# Altium schematic sheet mPCIe_Slot.SchDoc
size 594 x 420 mm; SheetNumber: 20; SheetTotal: 20
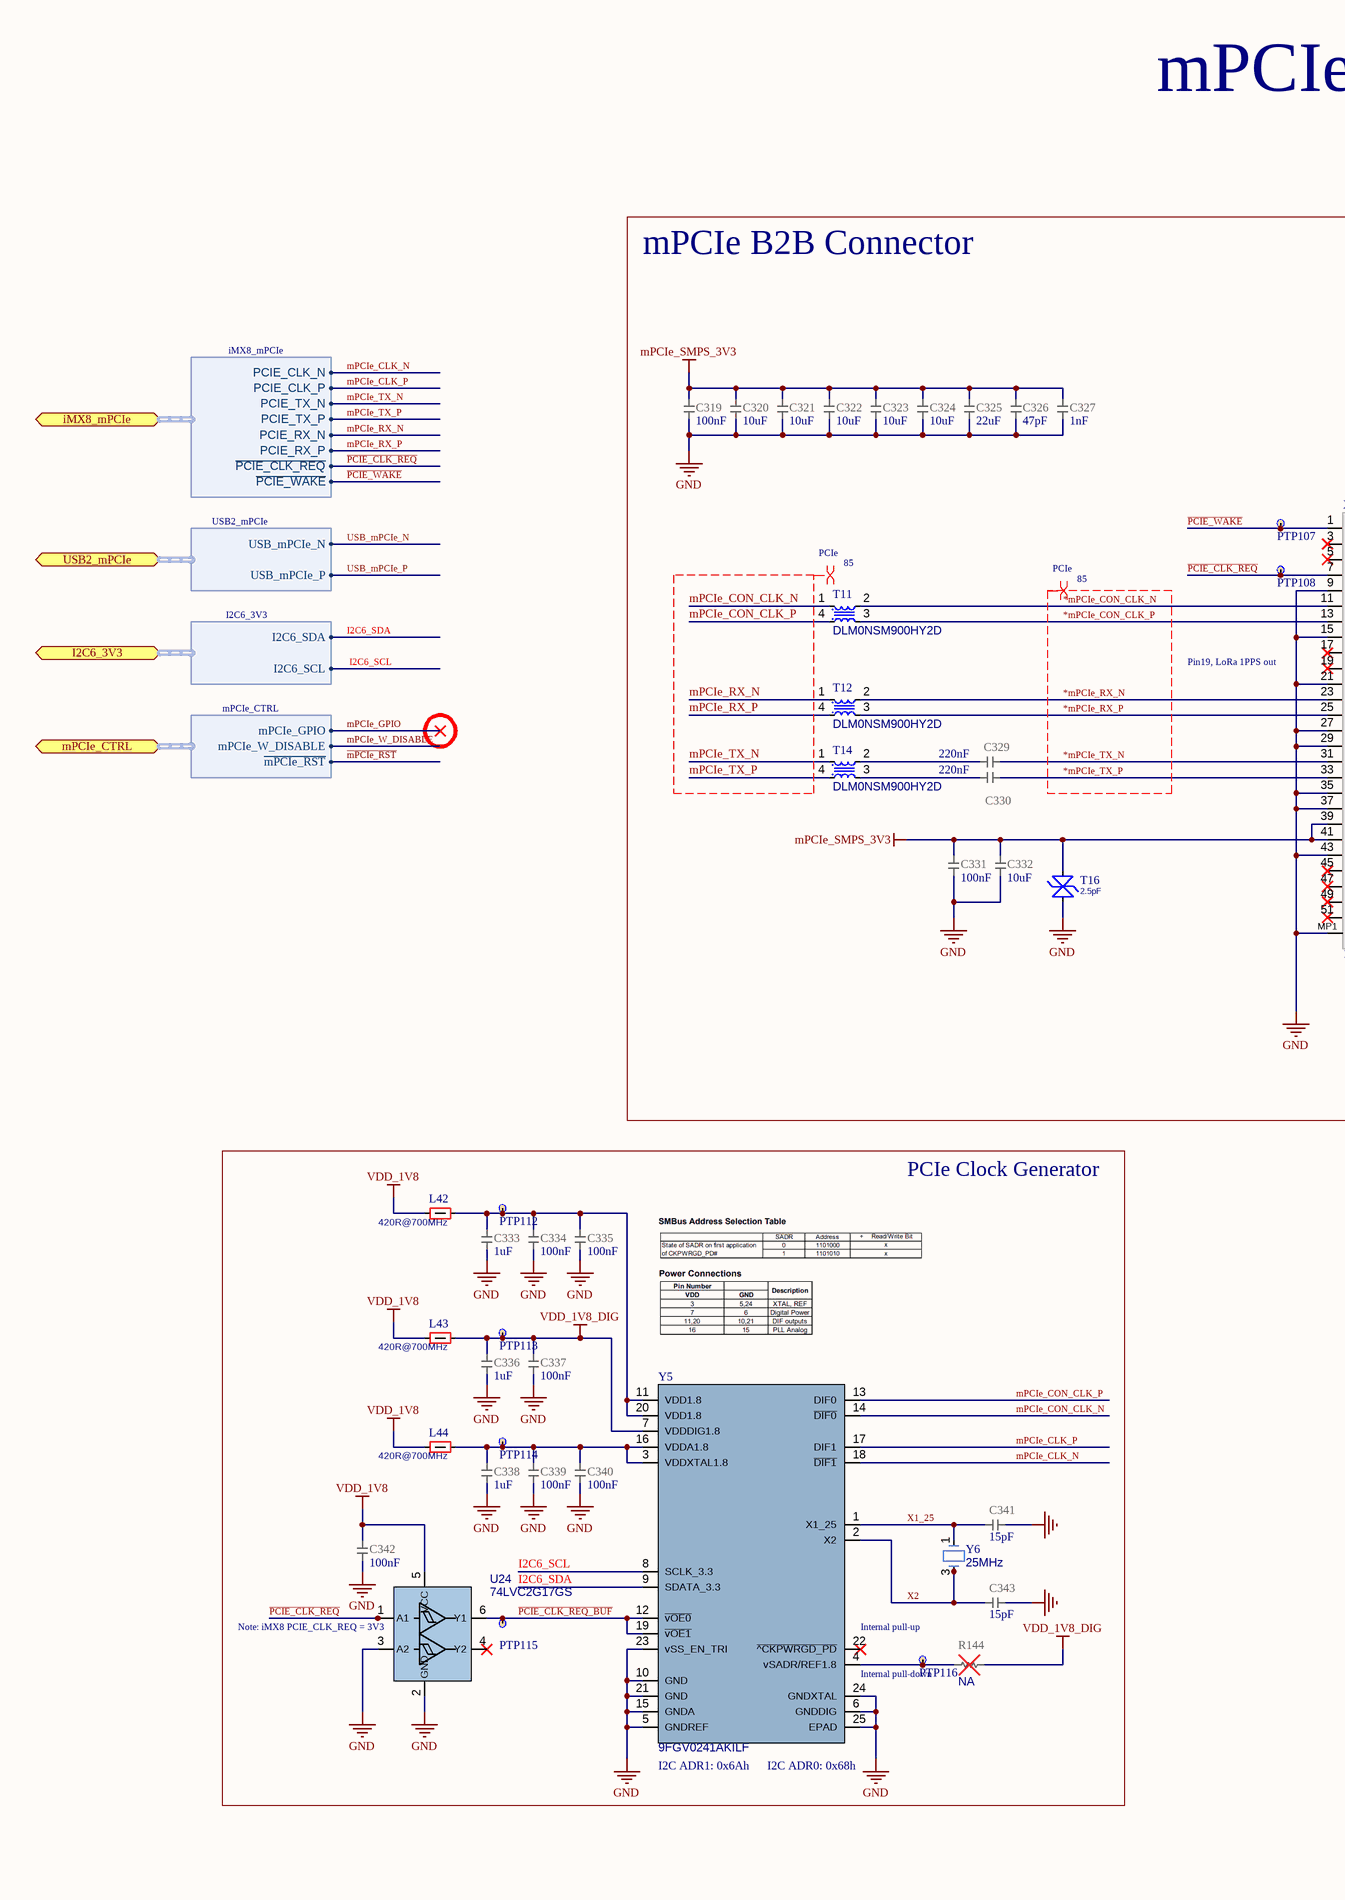
[diagram p0: mPCIe_Slot.SchDoc, left]
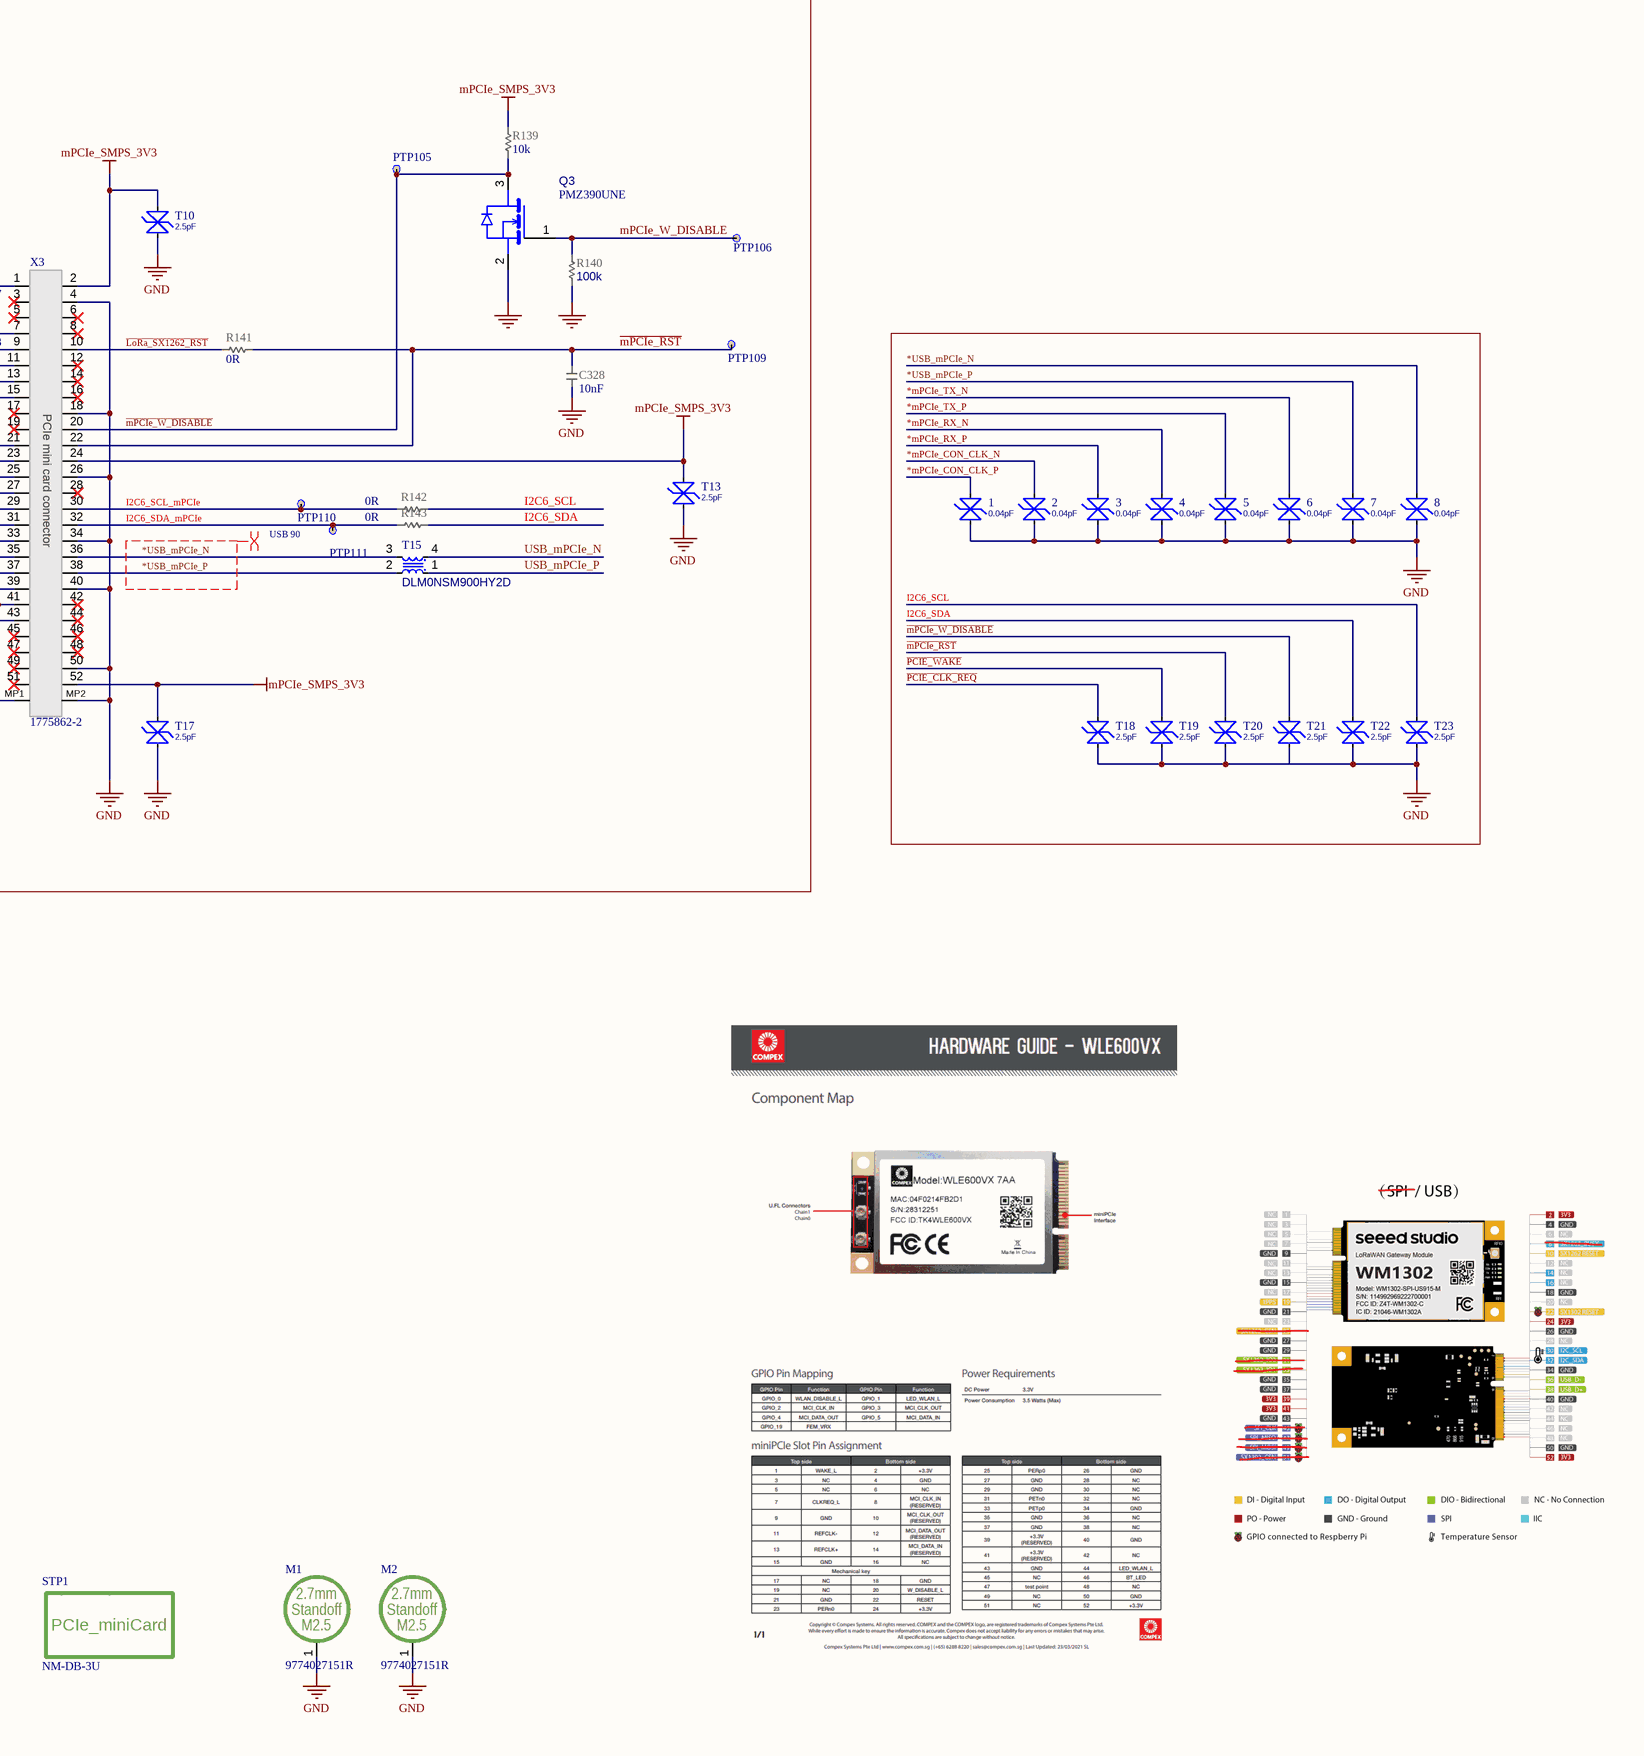
[diagram p1: mPCIe_Slot.SchDoc, right]

## Parts
1  value 0.04pF  [TVS_0201_EZAEG]  (hidden comment: TVS_0201_004_EZAEG1N)
2  value 0.04pF  [TVS_0201_EZAEG]  (hidden comment: TVS_0201_004_EZAEG1N)
3  value 0.04pF  [TVS_0201_EZAEG]  (hidden comment: TVS_0201_004_EZAEG1N)
4  value 0.04pF  [TVS_0201_EZAEG]  (hidden comment: TVS_0201_004_EZAEG1N)
5  value 0.04pF  [TVS_0201_EZAEG]  (hidden comment: TVS_0201_004_EZAEG1N)
6  value 0.04pF  [TVS_0201_EZAEG]  (hidden comment: TVS_0201_004_EZAEG1N)
7  value 0.04pF  [TVS_0201_EZAEG]  (hidden comment: TVS_0201_004_EZAEG1N)
8  value 0.04pF  [TVS_0201_EZAEG]  (hidden comment: TVS_0201_004_EZAEG1N)
C319  value 100nF  [CAP_0201_UN1Q]  (hidden comment: CAP_0201_100n_X7S_16V)
C320  value 10uF  [CAP_0402_H09W07_UN1Q]  (hidden comment: CAP_0402_10u_X6S)
C321  value 10uF  [CAP_0402_H09W07_UN1Q]  (hidden comment: CAP_0402_10u_X6S)
C322  value 10uF  [CAP_0402_H09W07_UN1Q]  (hidden comment: CAP_0402_10u_X6S)
C323  value 10uF  [CAP_0402_H09W07_UN1Q]  (hidden comment: CAP_0402_10u_X6S)
C324  value 10uF  [CAP_0402_H09W07_UN1Q]  (hidden comment: CAP_0402_10u_X6S)
C325  value 22uF  [CAP_0603_UN1Q]  (hidden comment: CAP_0603_22u_6.3V_X6S)
C326  value 47pF  [CAP_0201_UN1Q]  (hidden comment: CAP_0201_47p)
C327  value 1nF  [CAP_0201_UN1Q]  (hidden comment: CAP_0201_1n0)
C328  value 10nF  [CAP_0201_UN1Q]  (hidden comment: CAP_0201_10n_16V)
C329  value 220nF  [CAP_0201_UN1Q]  (hidden comment: CAP_0201_220n_10V_X6S)
C330  value 220nF  [CAP_0201_UN1Q]  (hidden comment: CAP_0201_220n_10V_X6S)
C331  value 100nF  [CAP_0201_UN1Q]  (hidden comment: CAP_0201_100n_X7S_16V)
C332  value 10uF  [CAP_0402_H09W07_UN1Q]  (hidden comment: CAP_0402_10u_X6S)
C333  value 1uF  [CAP_0201_UN1Q]  (hidden comment: CAP_0201_1uF_X6S)
C334  value 100nF  [CAP_0201_UN1Q]  (hidden comment: CAP_0201_100n_X7S_16V)
C335  value 100nF  [CAP_0201_UN1Q]  (hidden comment: CAP_0201_100n_X7S_16V)
C336  value 1uF  [CAP_0201_UN1Q]  (hidden comment: CAP_0201_1uF_X6S)
C337  value 100nF  [CAP_0201_UN1Q]  (hidden comment: CAP_0201_100n_X7S_16V)
C338  value 1uF  [CAP_0201_UN1Q]  (hidden comment: CAP_0201_1uF_X6S)
C339  value 100nF  [CAP_0201_UN1Q]  (hidden comment: CAP_0201_100n_X7S_16V)
C340  value 100nF  [CAP_0201_UN1Q]  (hidden comment: CAP_0201_100n_X7S_16V)
C341  value 15pF  [CAP_0201_UN1Q]  (hidden comment: CAP_0201_15p)
C342  value 100nF  [CAP_0201_UN1Q]  (hidden comment: CAP_0201_100n_X7S_16V)
C343  value 15pF  [CAP_0201_UN1Q]  (hidden comment: CAP_0201_15p)
L42  value 420R@700MHz  [IND_0201_UN1Q]  (hidden comment: FERRITE_0201_BLF_700MHz_420Ohm)
L43  value 420R@700MHz  [IND_0201_UN1Q]  (hidden comment: FERRITE_0201_BLF_700MHz_420Ohm)
L44  value 420R@700MHz  [IND_0201_UN1Q]  (hidden comment: FERRITE_0201_BLF_700MHz_420Ohm)
M1  Part Number: 9774027151R  [Standoff_2_7mm_M25_WURTH]  (hidden comment: Standoff_2_7mm_M25_WURTH)
M2  Part Number: 9774027151R  [Standoff_2_7mm_M25_WURTH]  (hidden comment: Standoff_2_7mm_M25_WURTH)
PTP105  PTP_0.4mm  [PTP_0.4mm]  (value not drawn)  (no BOM)
PTP106  PTP_0.4mm  [PTP_0.4mm]  (value not drawn)  (no BOM)
PTP107  PTP_0.4mm  [PTP_0.4mm]  (value not drawn)  (no BOM)
PTP108  PTP_0.4mm  [PTP_0.4mm]  (value not drawn)  (no BOM)
PTP109  PTP_0.4mm  [PTP_0.4mm]  (value not drawn)  (no BOM)
PTP110  PTP_0.4mm  [PTP_0.4mm]  (value not drawn)  (no BOM)
PTP111  PTP_0.4mm  [PTP_0.4mm]  (value not drawn)  (no BOM)
PTP112  PTP_0.4mm  [PTP_0.4mm]  (value not drawn)  (no BOM)
PTP113  PTP_0.4mm  [PTP_0.4mm]  (value not drawn)  (no BOM)
PTP114  PTP_0.4mm  [PTP_0.4mm]  (value not drawn)  (no BOM)
PTP115  PTP_0.4mm  [PTP_0.4mm]  (value not drawn)  (no BOM)
PTP116  PTP_0.4mm  [PTP_0.4mm]  (value not drawn)  (no BOM)
Q3  PMZ390UNE  [SOT883_DFN1006-3_NEXPERIA]
R139  value 10k  [RES_0201_UN1Q]  (hidden comment: RES_0201_10k)
R140  value 100k  [RES_0201_UN1Q]  (hidden comment: RES_0201_100k)
R141  value 0R  [RES_0201_UN1Q]  (hidden comment: RES_0201_0R)
R142  value 0R  [RES_0201_UN1Q]  (hidden comment: RES_0201_0R)
R143  value 0R  [RES_0201_UN1Q]  (hidden comment: RES_0201_0R)
R144  value NA  [RES_0201_UN1Q]  (hidden comment: RES_0201_NA)
STP1  Part Number: NM-DB-3U  [PCIe_miniCard]  (hidden comment: PCIe_miniCard)  (no BOM)
T10  value 2.5pF  [TVS_0201_EZAEG]  (hidden comment: TVS_0201_2.5pF_5V)
T11  Part Number: DLM0NSM900HY2D  [DLM0NSxxxxHY2_Murata]  (hidden comment: EMI_Filter_DLM0NSM900HY2)
T12  Part Number: DLM0NSM900HY2D  [DLM0NSxxxxHY2_Murata]  (hidden comment: EMI_Filter_DLM0NSM900HY2)
T13  value 2.5pF  [TVS_0201_EZAEG]  (hidden comment: TVS_0201_2.5pF_5V)
T14  Part Number: DLM0NSM900HY2D  [DLM0NSxxxxHY2_Murata]  (hidden comment: EMI_Filter_DLM0NSM900HY2)
T15  Part Number: DLM0NSM900HY2D  [DLM0NSxxxxHY2_Murata]  (hidden comment: EMI_Filter_DLM0NSM900HY2)
T16  value 2.5pF  [TVS_0201_EZAEG]  (hidden comment: TVS_0201_2.5pF_5V)
T17  value 2.5pF  [TVS_0201_EZAEG]  (hidden comment: TVS_0201_2.5pF_5V)
T18  value 2.5pF  [TVS_0201_EZAEG]  (hidden comment: TVS_0201_2.5pF_5V)
T19  value 2.5pF  [TVS_0201_EZAEG]  (hidden comment: TVS_0201_2.5pF_5V)
T20  value 2.5pF  [TVS_0201_EZAEG]  (hidden comment: TVS_0201_2.5pF_5V)
T21  value 2.5pF  [TVS_0201_EZAEG]  (hidden comment: TVS_0201_2.5pF_5V)
T22  value 2.5pF  [TVS_0201_EZAEG]  (hidden comment: TVS_0201_2.5pF_5V)
T23  value 2.5pF  [TVS_0201_EZAEG]  (hidden comment: TVS_0201_2.5pF_5V)
U24  74LVC2G17GS  [XSON6_SOT1202_Nexperia]
X3  Part Number: 1775862-2  [mPCIe_TE_1775862-2]  (hidden comment: 1775862-2_TE)
Y5  9FGV0241AKILF  [VFQFPN-24_9FGV0241AKLF]
Y6  value 25MHz  [XTAL_2016_UN1Q]  (hidden comment: XTAL_25M_ECS_2016_4-SMD)

## Blocks framed on the sheet
mPCIe B2B Connector: C319-C332 PTP105-PTP111 Q3 R139-R143 T10-T17 X3
PCIe Clock Generator: C333-C343 L42-L44 PTP112-PTP116 R144 U24 Y5 Y6

## Ports
I2C6_3V3 (bidir, harness I2C6_3V3), iMX8_mPCIe (bidir, harness iMX8_mPCIe), mPCIe_CTRL (bidir, harness mPCIe_CTRL), USB2_mPCIe (bidir, harness USB2_mPCIe)

## Harnesses
iMX8_mPCIe: PCIE_CLK_N, PCIE_CLK_P, PCIE_TX_N, PCIE_TX_P, PCIE_RX_N, PCIE_RX_P, ~{PCIE_CLK_REQ}, ~{PCIE_WAKE}
mPCIe_CTRL: mPCIe_GPIO, ~{mPCIe_RST}, mPCIe_W_DISABLE
USB2_mPCIe: USB_mPCIe_N, USB_mPCIe_P
I2C6_3V3: I2C6_SDA, I2C6_SCL

## Nets
GND: 1.1 2.1 3.1 4.1 5.1 6.1 7.1 8.1 C319.2 C320.1 C321.1 C322.1 C323.1 C324.1 C325.1 C326.1 C327.2 C328.1 C331.1 C332.2 C333.1 C334.1 C335.1 C336.1 C337.1 C338.1 C339.1 C340.1 C341.2 C342.1 C343.1 M1.1 M2.1 Q3.2(S) R140.1 T10.1 T13.1 T16.1 T17.1 T18.1 T19.1 T20.1 T21.1 T22.1 T23.1 U24.2(GND) U24.3(A2) X3.4 X3.9 X3.15 X3.18 X3.21 X3.26 X3.27 X3.29 X3.34 X3.35 X3.37 X3.40 X3.43 X3.50 X3.MP1 X3.MP2 Y5.5(GNDREF) Y5.6(GNDDIG) Y5.10(GND) Y5.15(GNDA) Y5.21(GND) Y5.23(vSS_EN_TRI) Y5.24(GNDXTAL) Y5.25(EPAD) Y6.2(GND) Y6.4(GND)
mPCIe_SMPS_3V3: C319.1 C320.2 C321.2 C322.2 C323.2 C324.2 C325.2 C326.2 C327.1 C331.2 C332.1 R139.2 T10.2 T13.2 T16.2 T17.2 X3.2 X3.24 X3.39 X3.41 X3.52
VDD_1V8: C342.2 L42.1 L43.1 L44.1 U24.5(VCC)
VDD_1V8_DIG: C336.2 C337.2 L43.2 PTP113.1(TP) R144.2 Y5.7(VDDDIG1.8)
*mPCIe_CON_CLK_N: 2.2 T11.2 X3.11
*mPCIe_CON_CLK_P: 1.2 T11.3 X3.13
*mPCIe_RX_N: 4.2 T12.2 X3.23
*mPCIe_RX_P: 3.2 T12.3 X3.25
*mPCIe_TX_N: 6.2 C329.2 X3.31
*mPCIe_TX_P: 5.2 C330.2 X3.33
*USB_mPCIe_N: 8.2 T15.3 X3.36
*USB_mPCIe_P: 7.2 T15.2 X3.38
~{LoRa_SX1262_RST}: R141.1 X3.10
~{mPCIe_RST}: C328.2 PTP109.1(TP) R141.2 T20.2 X3.22 ; port mPCIe_CTRL.~{mPCIe_RST}
~{mPCIe_W_DISABLE}: PTP105.1(TP) Q3.3(D) R139.1 T21.2 X3.20
~{PCIE_CLK_REQ}: PTP108.1(TP) T18.2 U24.1(A1) X3.7 ; port iMX8_mPCIe.~{PCIE_CLK_REQ}
~{PCIE_CLK_REQ_BUF}: PTP115.1(TP) U24.6(Y1) Y5.12(~{vOE0}) Y5.19(~{vOE1})
~{PCIE_WAKE}: PTP107.1(TP) T19.2 X3.1 ; port iMX8_mPCIe.~{PCIE_WAKE}
I2C6_SCL: R142.2 T23.2 Y5.8(SCLK_3.3) ; port I2C6_3V3.I2C6_SCL
I2C6_SCL_mPCIe: PTP110.1(TP) R142.1 X3.30
I2C6_SDA: R143.2 T22.2 Y5.9(SDATA_3.3) ; port I2C6_3V3.I2C6_SDA
I2C6_SDA_mPCIe: PTP111.1(TP) R143.1 X3.32
mPCIe_CLK_N: Y5.18(~{DIF1}) ; port iMX8_mPCIe.PCIE_CLK_N
mPCIe_CLK_P: Y5.17(DIF1) ; port iMX8_mPCIe.PCIE_CLK_P
mPCIe_CON_CLK_N: T11.1 Y5.14(~{DIF0})
mPCIe_CON_CLK_P: T11.4 Y5.13(DIF0)
mPCIe_GPIO: port mPCIe_CTRL.mPCIe_GPIO
mPCIe_RX_N: T12.1 ; port iMX8_mPCIe.PCIE_RX_N
mPCIe_RX_P: T12.4 ; port iMX8_mPCIe.PCIE_RX_P
mPCIe_TX_N: T14.1 ; port iMX8_mPCIe.PCIE_TX_N
mPCIe_TX_P: T14.4 ; port iMX8_mPCIe.PCIE_TX_P
mPCIe_W_DISABLE: PTP106.1(TP) Q3.1(G) R140.2 ; port mPCIe_CTRL.mPCIe_W_DISABLE
USB_mPCIe_N: T15.4 ; port USB2_mPCIe.USB_mPCIe_N
USB_mPCIe_P: T15.1 ; port USB2_mPCIe.USB_mPCIe_P
X1_25: C341.1 Y5.1(X1_25) Y6.1
X2: C343.2 Y5.2(X2) Y6.3
NetC329_1: C329.1 T14.2
NetC330_1: C330.1 T14.3
NetC333_2: C333.2 C334.2 C335.2 L42.2 PTP112.1(TP) Y5.11(VDD1.8) Y5.20(VDD1.8)
NetC338_2: C338.2 C339.2 C340.2 L44.2 PTP114.1(TP) Y5.3(VDDXTAL1.8) Y5.16(VDDA1.8)
NetPTP116_1: PTP116.1(TP) R144.1 Y5.4(vSADR/REF1.8)

Not connected (* = marked no-connect by the designer): U24 4(Y2)*; X3 3* 5* 6* 8* 12* 14* 16* 17* 19* 28* 42* 44* 45* 46* 47* 48* 49* 51*; Y5 22(~{^CKPWRGD_PD})*

## Layout directives
differential pair; differential pair class 90; net class USB; rule Matched Net Lengths [Tolerance = 0.3mm]: *USB_mPCIe_N, *USB_mPCIe_P
differential pair; net class PCIe; rule Matched Net Lengths [Tolerance = 0.1mm]; differential pair class 85: *mPCIe_CON_CLK_N, *mPCIe_CON_CLK_P, *mPCIe_RX_N, *mPCIe_RX_P, *mPCIe_TX_N, *mPCIe_TX_P, mPCIe_CON_CLK_N, mPCIe_CON_CLK_P, mPCIe_RX_N, mPCIe_RX_P, mPCIe_TX_N, mPCIe_TX_P

## Notes on the sheet
- mPCIe SLOT
- Pin19, LoRa 1PPS out
- (near U24) Note: iMX8 PCIE_CLK_REQ = 3V3
- Internal pull-up
- Internal pull-down
- (near Y5) I2C ADR1: 0x6Ah
- (near Y5) I2C ADR0: 0x68h
- DWG NO:
- REV:
- THIS DOCUMENT AND THE DATA DISCLOSED HEREIN OR
- HEREWITH IS THE PROPERTY OF ALTIUM LIMITED AND MAY
- BE FREELY DISTRIBUTED IN WHOLE. NO RIGHTS ARE
- RESERVED OR EXPRESS OR IMPLIED WARANTEE GIVEN.
- REVISION
- DESCRIPTION
- DATE
- APPROVED
- ENG:
- APPROVALS
- PROJECT
- DSN:
- CHK:
- REFERENCE DOCUMENTS
- PROJECT REVISION:
- TITLE
- DOCUMENT REVISION:
- DESIGN ITEM:
- BOM:
- FAB DWG:
- PCB DWG:
- ASSY DWG:
- SCALE:
- A2
- SIZE
- CAGE CODE
- FILE NAME
- DWG NO.
- SHEET
- OF
- REV
- (in symbol CMP-001-001437-1) PCIe mini card connector
- (in symbol CMP-012-000004-10) 2.7mm; M2.5

## Library data of the parts
1-8 = CMP-001-000774-6: ESD Protection Panasonic EZAEG1N50AC; Voltage: 30V; Sort order: 402; HasBeenBuilt: False; System: Discrete; Part Number: EZAEG1N50AC; Package: 0201; Manufacturer: Panasonic; Operating temperature range: -55C ... +125C; Dimensions WxLxH: 0.33 mm x 0.63mm x 0.26mm; ComponentLink1Description: 1_Datasheet; ComponentLink1URL: https://industrial.panasonic.com/ww/products/pt/esd-suppressor/models/EZAEG1N50AC; ComponentLink2Description: 2_Product page; ComponentLink3Description: 3_X-information; ComponentLink4Description: 4_X-information; Creation date: 17102023; ClassName: SMALL; Source: Discrete_UN1Q.SchLib; Manufacturer Part Number: EZAEG1N50AC; Component Type: ESD & EMI
C319 C331 C334 C335 C337 C339 C340 C342 = CMP-001-000385-16: CAP; Part Number: GRM033C71C104KE14D; Manufacturer: Murata; Temperature characteristics: X7S; Tolerance: +/-10%; Sort order: 302; HasBeenBuilt: TBD; Alternative component: Allowed; Voltage: 16V; System: RLC; Package: 0201; ClassName: SMALL; ComponentLink1Description: 1_Datasheet; ComponentLink2Description: 2_Product page; ComponentLink3Description: 3_X-information; ComponentLink4Description: 4_X-information; Creation date: 20190101; Source: RLC_UN1Q.SchLib; Manufacturer Part Number: GRM033C71C104KE14D; Component Type: Capacitor
C320-C324 C332 = CMP-001-000883-14: CAP; Part Number: GMC04X6S106M6R3NT; Manufacturer: Cal-Chip Electronics, Inc.; Manufacturer: Cal-Chip Electronics; Temperature characteristics: X6S; Voltage: 6.3V; Tolerance: +/-20%; Sort order: 304; HasBeenBuilt: TBD; Alternative component: Allowed; System: RLC; Package: 0402; ComponentLink1Description: 1_Datasheet; ComponentLink2Description: 2_Product page; ComponentLink3Description: 3_X-information; ComponentLink4Description: 4_X-information; Creation date: 26042024; Manufacturer Part Number: GMC04X6S106M6R3NT; Component Type: Capacitor
C325 = CMP-001-000890-13: CAP; Part Number: GRM188C80J226ME15D; Manufacturer: Murata; Temperature characteristics: X6S; Tolerance: +/-20%; Sort order: 306; HasBeenBuilt: TBD; Alternative component: Allowed; Voltage: 6.3V; System: RLC; Package: 0603; ComponentLink1Description: 1_Datasheet; ComponentLink2Description: 2_Product page; ComponentLink3Description: 3_X-information; ComponentLink4Description: 4_X-information; Creation date: 26042024; Manufacturer Part Number: GRM188C80J226ME15D; Component Type: Capacitor
C326 = CMP-001-000292-14: CAP; Part Number: GRM0335C1H470JA01D; Manufacturer: Samsung; Manufacturer: Murata; Temperature characteristics: C0G; Voltage: 50V; Tolerance: +/-5%; Sort order: 302; HasBeenBuilt: TBD; Alternative component: Allowed; System: RLC; Package: 0201; ClassName: SMALL; ComponentLink1Description: 1_Datasheet; ComponentLink2Description: 2_Product page; ComponentLink3Description: 3_X-information; ComponentLink4Description: 4_X-information; Creation date: 20190101; Source: RLC_UN1Q.SchLib; Manufacturer Part Number: GRM0335C1H470JA01D; Component Type: Capacitor
C327 = CMP-001-000271-14: CAP; Part Number: GRM033R71E102KA01D; Manufacturer: Samsung; Manufacturer: Murata; Temperature characteristics: X7R; Tolerance: +/-10%; Sort order: 302; HasBeenBuilt: TBD; Alternative component: Allowed; Voltage: 25V; System: RLC; Package: 0201; ComponentLink1Description: 1_Datasheet; ComponentLink2Description: 2_Product page; ComponentLink3Description: 3_X-information; ComponentLink4Description: 4_X-information; Creation date: 20190101; ClassName: SMALL; Manufacturer Part Number: GRM033R71E102KA01D; Component Type: Capacitor
C328 = CMP-001-000335-15: CAP; Part Number: GRM033R71C103KE14D; Manufacturer: Murata; Temperature characteristics: X7R; Tolerance: +/-10%; Sort order: 302; HasBeenBuilt: TBD; Alternative component: Allowed; Voltage: 16V; System: RLC; Package: 0201; ClassName: SMALL; ComponentLink1Description: 1_Datasheet; ComponentLink2Description: 2_Product page; ComponentLink3Description: 3_X-information; ComponentLink4Description: 4_X-information; Creation date: 20190101; Source: RLC_UN1Q.SchLib; Manufacturer Part Number: GRM033R71C103KE14D; Component Type: Capacitor
C329 C330 = CMP-001-000889-11: CAP; Part Number: GRM033C81A224KE01D; Manufacturer: Murata; Temperature characteristics: X6S; Voltage: 10V; Tolerance: +/-20%; Sort order: 302; HasBeenBuilt: TBD; Alternative component: Allowed; System: RLC; Package: 0201; Dimensions WxLxH: 0.35; ComponentLink1Description: 1_Datasheet; ComponentLink2Description: 2_Product page; ComponentLink3Description: 3_X-information; ComponentLink4Description: 4_X-information; Creation date: 26042024; ClassName: SMALL; Manufacturer Part Number: GRM033C81A224KE01D; Component Type: Capacitor
C333 C336 C338 = CMP-001-000336-15: CAP; Part Number: KGM03CS61A105MH; Manufacturer: Kyocera; Manufacturer: KYOCERA AVX; Temperature characteristics: X6S; Voltage: 10V; Tolerance: +/-20%; Sort order: 302; HasBeenBuilt: False; Alternative component: Allowed; System: RLC; Package: 0201; Operating temperature range: -55C to +105C; ClassName: SMALL; ComponentLink1Description: 1_Datasheet; ComponentLink2Description: 2_Product page; ComponentLink3Description: 3_X-information; ComponentLink4Description: 4_X-information; Creation date: 20190101; Source: RLC_UN1Q.SchLib; Manufacturer Part Number: KGM03CS61A105MH; Component Type: Capacitor
C341 C343 = CMP-001-000269-15: CAP; Part Number: GRM0335C1H150JA01D; Manufacturer: Murata; Temperature characteristics: C0G; Voltage: 50V; Tolerance: +/-5%; Sort order: 302; HasBeenBuilt: TBD; Alternative component: Allowed; System: RLC; Package: 0201; ComponentLink1Description: 1_Datasheet; ComponentLink2Description: 2_Product page; ComponentLink3Description: 3_X-information; ComponentLink4Description: 4_X-information; Creation date: 20190101; ClassName: SMALL; Source: RLC_UN1Q.SchLib; Manufacturer Part Number: GRM0335C1H150JA01D; Component Type: Capacitor
L42-L44 = CMP-001-000747-7: FERRITE; Part Number: BLF03JD421GZE; Manufacturer: Murata; HasBeenBuilt: False; System: Discrete; Sort order: 362; Tolerance: 25%; ComponentLink3Description: 3_X-information; Creation date: 20200304; ClassName: SMALL; ComponentLink1Description: 1_Datasheet; ComponentLink2Description: 2_Product page; Package: 0201; ComponentLink4Description: 4_X-information; Source: Discrete_UN1Q.SchLib; Operating temperature range: -55 ... +125C; Manufacturer Part Number: BLF03JD421GZE; Component Type: Ferrite
M1 M2 = CMP-012-000004-10: Standoff 2.7 mm M2.5 Hole 3.7 mm; Manufacturer: WURTH; Manufacturer: Wurth Elektronik; Sort order: 101; HasBeenBuilt: Saluki3; ComponentLink1Description: 1_Datasheet; ComponentLink1URL: https://www.we-online.com/components/products/datasheet/9774027151R.pdf; Creation date: 20230621; Dimensions WxLxH: M2.5 5.1x4.0mm; ComponentLink2Description: 2_Product page; ComponentLink2URL: https://www.we-online.com/catalog/en/SMSI_SMT_STEEL_SPACER_M2_5_THREAD_INTERNAL; ComponentLink3Description: 3_X-information; ComponentLink4Description: 4_X-information; System: Standoff; ECCN: EAR99; Source: EMECH_UN1Q.SchLib; Design Item ID: Standoff_2_7mm_M25_WURTH; RoHS: RoHS3 with ex; Manufacturer Part Number: 9774027151R; Component Type: Standoff
PTP105 = CMP-001-001296-3: Production Testpoint 0.4mm. Flying probe. Use 1mm pitch.; ComponentLink4Description: 4_X-information; ComponentLink1Description: 1_Datasheet; Part Number: PTP 0.4mm; Sort order: -; ClassName: SMALL; System: Test Point; HasBeenBuilt: -; Design Item ID: PTP_0.4mm; ComponentLink3Description: 3_X-information; Creation date: 20240909; ComponentLink2Description: 2_Product page
PTP106-PTP116 = CMP-001-001296-3: Production Testpoint 0.4mm. Flying probe. Use 1mm pitch.; Part Number: PTP 0.4mm; ComponentLink4Description: 4_X-information; ComponentLink1Description: 1_Datasheet; Sort order: -; ClassName: SMALL; System: Test Point; HasBeenBuilt: -; Design Item ID: PTP_0.4mm; ComponentLink3Description: 3_X-information; Creation date: 20240909; ComponentLink2Description: 2_Product page; Component Type: Test Point
Q3 = CMP-031-000024-4: NMOS Transistor, 30V; Manufacturer: Nexperia; Sort order: 447; HasBeenBuilt: CCB30_1; System: Discrete; Part Number: PMZ390UNE; ComponentLink1Description: 1_Datasheet; ComponentLink1URL: https://assets.nexperia.com/documents/data-sheet/PMZ390UNE.pdf; ComponentLink2Description: 2_Product page; ComponentLink3Description: 3_X-information; ComponentLink4Description: 4_X-information; Creation date: 20230913; Dimensions WxLxH: 1.0 × 0.6 × 0.48 mm; Operating temperature range: -55 ... +150 °C; Package: DFN1006-3(SOT883); ClassName: SMALL; Source: UUDET_KOMPONENTIT.SchLib; Manufacturer Part Number: PMZ390UNE; Component Type: Transistor
R139 = CMP-001-000446-13: RES; Part Number: RC0201FR-0710KL; Manufacturer: YAGEO; Power Rating: 1/20W; Sort order: 322; HasBeenBuilt: TBD; Tolerance: 1%; Alternative component: Allowed; System: RLC; Package: 0201; ClassName: SMALL; ComponentLink1Description: 1_Datasheet; ComponentLink2Description: 2_Product page; ComponentLink3Description: 3_X-information; ComponentLink4Description: 4_X-information; Creation date: 20190101; Source: RLC_UN1Q.SchLib; Component Type: Resistor
R140 = CMP-001-000526-11: RES; Part Number: RC0201FR-07100KL; Manufacturer: YAGEO; Tolerance: 1%; Power Rating: 1/20W; Sort order: 322; HasBeenBuilt: TBD; Alternative component: Allowed; System: RLC; Package: 0201; ClassName: SMALL; ComponentLink1Description: 1_Datasheet; ComponentLink2Description: 2_Product page; ComponentLink3Description: 3_X-information; ComponentLink4Description: 4_X-information; Creation date: 20190101; Source: RLC_UN1Q.SchLib; Component Type: Resistor
R141 = CMP-001-000429-13: RES; Part Number: RC0201JR-070RL; Manufacturer: YAGEO; HasBeenBuilt: TBD; Sort order: 322; System: RLC; Alternative component: Allowed; Tolerance: 5%; Power Rating: 1/20W; Creation date: 20190101; Source: RLC_UN1Q.SchLib; ComponentLink4Description: 4_X-information; ComponentLink2Description: 2_Product page; ClassName: SMALL; ComponentLink3Description: 3_X-information; Package: 0201; ComponentLink1Description: 1_Datasheet
R142 R143 = CMP-001-000429-13: RES; Part Number: RC0201JR-070RL; Manufacturer: YAGEO; Tolerance: 5%; Power Rating: 1/20W; Sort order: 322; HasBeenBuilt: TBD; Alternative component: Allowed; System: RLC; Package: 0201; ClassName: SMALL; ComponentLink1Description: 1_Datasheet; ComponentLink2Description: 2_Product page; ComponentLink3Description: 3_X-information; ComponentLink4Description: 4_X-information; Creation date: 20190101; Source: RLC_UN1Q.SchLib; Component Type: Resistor
R144 = CMP-001-000434-10: Not Assembled - RES; Sort order: 999; HasBeenBuilt: TBD; System: RLC; Package: 0201; ClassName: SMALL; ComponentLink1Description: 1_Datasheet; ComponentLink2Description: 2_Product page; ComponentLink3Description: 3_X-information; ComponentLink4Description: 4_X-information; Creation date: 20190101; Source: RLC_UN1Q.SchLib; Component Type: Resistor
STP1 = CMP-014-000007-4: Manufacturer: Doodle Labs; Sort order: 999; Remark: STEP; System: EMECH; ComponentLink1Description: 1_Datasheet; ComponentLink1URL: https://doodlelabs.com/wp-content/uploads/Doodle-Labs-NM-DB-3-Data-Sheet.pdf; ComponentLink2Description: 2_Product page; ComponentLink3Description: 3_X-information; ComponentLink4Description: 4_X-information; Design Item ID: PCIe_miniCard; Source: EMECH_UN1Q.SchLib; ClassName: STEP; Component Type: STEP Model
T10 T13 T16-T23 = CMP-001-001100-1: ESD Protection  TVS Diodes SMP Diode 0201 5vdc 2.5pf <12v clamp@1a; Part Number: GG0201052R542P; Manufacturer: KYOCERA AVX; Voltage: 5.0V; Sort order: 402; System: Discrete; Package: 0201; Operating temperature range: -55 ... +125C; ComponentLink1Description: 1_Datasheet; ComponentLink1URL: https://datasheets.kyocera-avx.com/AVX-GiGuard.pdf; ComponentLink2Description: 2_Product page; ComponentLink3Description: 3_X-information; ComponentLink4Description: 4_X-information; Creation date: 20250310; ClassName: SMALL; Manufacturer: Kyocera AVX; Manufacturer Part Number: GG0201052R542P; Component Type: ESD & EMI
T11 T12 T14 T15 = CMP-001-000968-3: EMI Filter 90Ω 100MHz 100mA 5V; Manufacturer: Murata; Sort order: 441; HasBeenBuilt: Cmod2_01; System: Discrete; Package: 0.85x0.65x0.50; Operating temperature range: -40 ... +85 °C; Dimensions WxLxH: 0.85x0.65x0.50; ComponentLink1Description: 1_Datasheet; ComponentLink1URL: https://www.murata.com/en-us/api/pdfdownloadapi?cate=cgsubChipCommoModeChokeCoil&partno=DLM0NSM900HY2%23; ComponentLink2Description: 2_Product page; ComponentLink2URL: https://www.murata.com/products/productdetail?partno=DLM0NSM900HY2%23; ComponentLink3Description: 3_X-information; ComponentLink4Description: 4_X-information; Creation date: 20230103; Source: UUDET_KOMPONENTIT.SchLib; Manufacturer Part Number: DLM0NSM900HY2D; Component Type: ESD & EMI
U24 = CMP-001-001197-8: Non-inverting, Schmitt-Trigger, CMOS.; Manufacturer: Nexperia; Manufacturer Part Number: 74LVC2G17GS,132; Sort order: 446; System: IC; ComponentLink1Description: 1_Datasheet; ComponentLink1URL: https://assets.nexperia.com/documents/data-sheet/74LVC2G17.pdf; ComponentLink2Description: 2_Product page; ComponentLink2URL: https://www.nexperia.com/search?q=74LVC2G&searchCategory=product; ComponentLink3Description: 3_X-information; ComponentLink4Description: 4_X-information; Creation date: 06032024; Dimensions WxLxH: 1.0 mm x 1.0 mm x 0.35mm; Operating temperature range: -40C ... +125C; Package: XSON6; Part Number: 74LVC2G17GS; Component Type: Logic
X3 = CMP-001-001437-1: TE PCIe connector, 52 pins, height 4 mm; Manufacturer: TE Connectivity; Sort order: 111; ClassName: BIG; ComponentLink1Description: 1_Datasheet; ComponentLink1URL: https://www.te.com/commerce/DocumentDelivery/DDEController?Action=srchrtrv&DocNm=8-1773459-7_EXPRESS_MINI_CARD_QRG&DocType=Data%20Sheet&DocLang=English&DocFormat=pdf&PartCntxt=1775862-2; ComponentLink2Description: 2_Product page; ComponentLink2URL: https://www.te.com/en/product-1775862-2.html; ComponentLink3Description: 3_X-information; ComponentLink4Description: 4_X-information; Creation date: 20250617; Dimensions WxLxH: 5.56 x 29.9 x 5.2mm; Manufacturer: TE; Operating temperature range: -55 ... +85 C; System: Connector; ECCN: EAR99; RoHS: RoHS 2; Manufacturer Part Number: 1775862-2; Component Type: Interface Connector
Y5 = CMP-001-001278-2: PCIe Clock Generator, 2-output PCIE GEN 1–4 CLOCK GENERATOR; Manufacturer: Renesas Electronics Corporation; Manufacturer: Renesas; Sort order: 455; System: IC; ECCN: EAR99; ComponentLink3Description: 3_X-information; ComponentLink4Description: 4_X-information; Operating temperature range: -40 .... +85 °C; ComponentLink1URL: https://www.renesas.com/us/en/document/dst/9fgv0241-datasheet; Creation date: 20240816; Part Number: 9FGV0241AKILF; Dimensions WxLxH: 4.0x4.0x0.9mm; ComponentLink1Description: 1_Datasheet; Design Item ID: 9FGV0241AKILF; Package: VFQFPN-24; ComponentLink2Description: 2_Product page; ClassName: BIG; Manufacturer Part Number: 9FGV0241AKILF; Component Type: Timing
Y6 = CMP-001-000909-8: Crystal 25MHz ±10ppm, 10pF; Part Number: ECS-250-10-37B-CTN; Manufacturer: ECS Inc.; Manufacturer: ECS International; Manufacturer Part Number: ECS-250-10-37B-CTN-TR; Tolerance: +/-10ppm; Sort order: 455; HasBeenBuilt: Cmod2_01; System: Discrete; Operating temperature range: -40 ... +85C; Dimensions WxLxH: 2 x 1.6mm x 0.65mm; Creation date: 20230102; ComponentLink1Description: 1_Datasheet; ComponentLink1URL: https://ecsxtal.com/store/pdf/ECX-1637B.pdf; ComponentLink2Description: 2_Product_page; ComponentLink2URL: https://ecsxtal.com/products/crystals/surface-mount-crystals/ecx-1637b/; ComponentLink3Description: 3_X-information; ComponentLink4Description: 4_X-information; ECCN: EAR99; Source: UUDET_KOMPONENTIT.SchLib; RoHS: RoHS3; Component Type: Crystal & Oscillator